# Altium schematic sheet Car-Rear.SchDoc
size A4
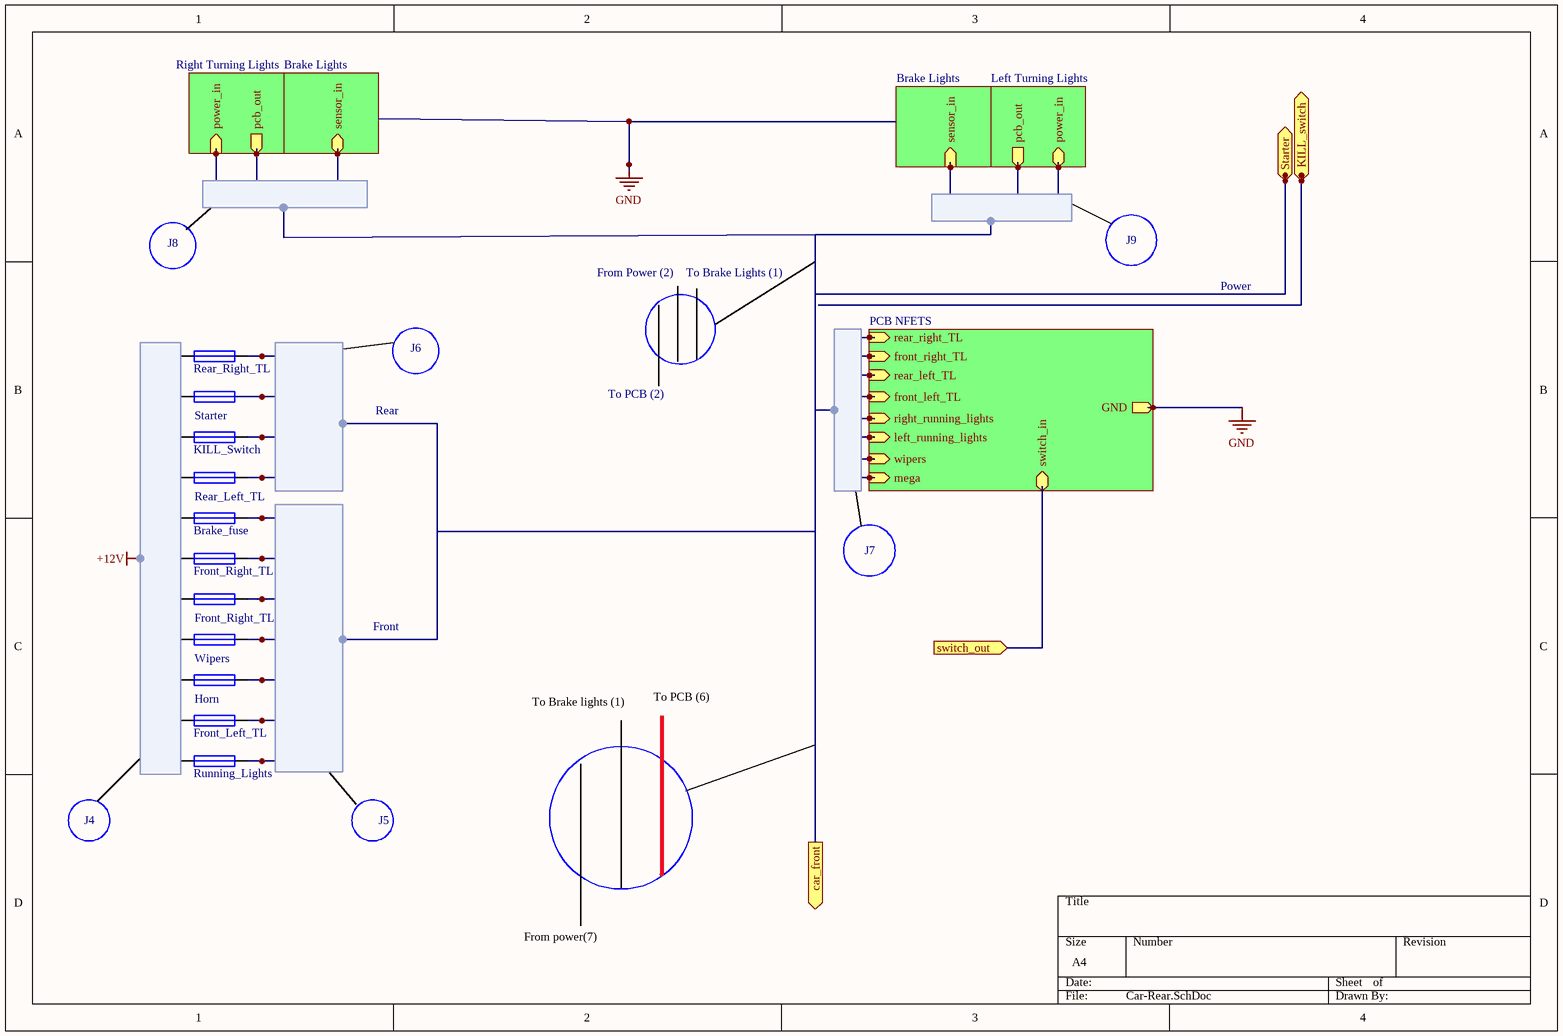
[diagram p0: Car-Rear.SchDoc]

## Parts
(Parts that share a designator on the sheet are numbered #1, #2 ... from top to bottom, then left to right.)
?#1  Rear_Right_TL  [PIN-W2/E2.8]
?#2  Starter  [PIN-W2/E2.8]
?#3  KILL_Switch  [PIN-W2/E2.8]
?#4  Rear_Left_TL  [PIN-W2/E2.8]
?#5  Brake_fuse  [PIN-W2/E2.8]
?#6  Front_Right_TL  [PIN-W2/E2.8]
?#7  Front_Right_TL  [PIN-W2/E2.8]
?#8  Wipers  [PIN-W2/E2.8]
?#9  Horn  [PIN-W2/E2.8]
?#10  Front_Left_TL  [PIN-W2/E2.8]
?#11  Running_Lights  [PIN-W2/E2.8]

## Sub-sheets
Designator = Left Turning Lights: pcb_out (out), power_in
Designator = Brake Lights: sensor_in (in)
Designator = Brake Lights: sensor_in
Designator = Right Turning Lights: pcb_out (out), power_in (in)
Designator = PCB NFETS: rear_right_TL (in), front_right_TL (in), rear_left_TL (in), front_left_TL (in), right_running_lights (in), left_running_lights (in), wipers (in), mega (in), GND (out), switch_in

## Ports
car_front (out), KILL_switch (out), Starter (out), switch_out (in)

## Harnesses
?: 
J: 
Harness: 

## Nets
GND: sheet Designator/GND

Not connected (* = marked no-connect by the designer): ?#1 1 2; ?#2 1 2; ?#3 1 2; ?#4 1 2; ?#5 1 2; ?#6 1 2; ?#7 1 2; ?#8 1 2; ?#9 1 2; ?#10 1 2; ?#11 1 2

## Buses and harness runs
bus port switch_out = sheet Designator/switch_in

## Notes on the sheet
- J8
- J9
- From Power (2)
- To Brake Lights (1)
- Power
- J6
- Rear
- To PCB (2)
- J7
- Front
- To Brake lights (1)
- To PCB (6)
- J4
- J5
- From power(7)
- Labels drawn without touching a wire or pin: +12V

## Library data of the parts
?#1-?#11 = Fuse 1: Fuse; Published: 8-Jun-2000; LatestRevisionDate: 17-Jul-2002; LatestRevisionNote: Re-released for DXP Platform.; PackageReference: PIN-W2/E2.8; Publisher: Altium Limited; PackageDescription: Thru-Hole; 2 Leads